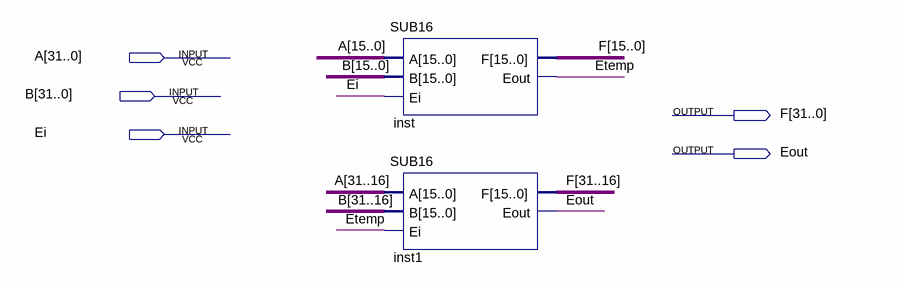
[diagram p0: schematic sheet]
// Quartus schematic SUB32.bdf as structural Verilog: 2 symbols, 5 pins
module SUB32 (
  input  [31:0] A,
  input  [31:0] B,
  input  Ei,
  output [31:0] F,
  output Eout
);

  wire Etemp;

  SUB16 inst (.A(A[15:0]), .B(B[15:0]), .Ei(Ei), .F(F[15:0]), .Eout(Etemp));
  SUB16 inst1 (.A(A[31:16]), .B(B[31:16]), .Ei(Etemp), .F(F[31:16]), .Eout(Eout));
endmodule
